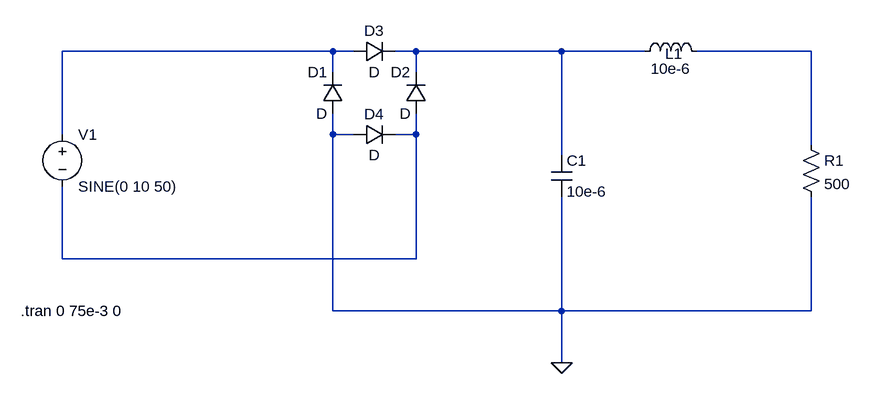
[diagram p0: schematic full_wave_rectifier.asc]
full_wave_rectifier.asc, the LTspice schematic file:
Version 4
SHEET 1 1124 680
WIRE 320 160 -96 160
WIRE 352 160 320 160
WIRE 448 160 416 160
WIRE 672 160 448 160
WIRE 800 160 672 160
WIRE 1056 160 880 160
WIRE 320 192 320 160
WIRE 448 192 448 160
WIRE -96 288 -96 160
WIRE 320 288 320 256
WIRE 352 288 320 288
WIRE 448 288 448 256
WIRE 448 288 416 288
WIRE 1056 304 1056 160
WIRE 672 320 672 160
WIRE -96 480 -96 368
WIRE 448 480 448 288
WIRE 448 480 -96 480
WIRE 320 560 320 288
WIRE 672 560 672 384
WIRE 672 560 320 560
WIRE 1056 560 1056 384
WIRE 1056 560 672 560
WIRE 672 640 672 560
FLAG 672 640 0
SYMBOL voltage -96 272 R0
SYMATTR InstName V1
SYMATTR Value SINE(0 10 50)
SYMBOL diode 336 256 R180
WINDOW 0 24 64 Left 2
WINDOW 3 24 0 Left 2
SYMATTR InstName D1
SYMBOL diode 464 256 R180
WINDOW 0 24 64 Left 2
WINDOW 3 24 0 Left 2
SYMATTR InstName D2
SYMBOL diode 352 176 R270
WINDOW 0 32 32 VTop 2
WINDOW 3 0 32 VBottom 2
SYMATTR InstName D3
SYMBOL diode 352 304 R270
WINDOW 0 32 32 VTop 2
WINDOW 3 0 32 VBottom 2
SYMATTR InstName D4
SYMBOL cap 656 320 R0
SYMATTR InstName C1
SYMATTR Value 10e-6
SYMBOL ind 784 176 R270
WINDOW 0 -3 61 VTop 2
WINDOW 3 5 56 VBottom 2
SYMATTR InstName L1
SYMATTR Value 10e-6
SYMBOL res 1040 288 R0
SYMATTR InstName R1
SYMATTR Value 500
TEXT -160 560 Left 2 !.tran 0 75e-3 0

The netlist it stands for:
* full_wave_rectifier.asc
V1 N001 N004 SINE(0 10 50)
D1 0 N001 D
D2 N004 N002 D
D3 N001 N002 D
D4 0 N004 D
C1 N002 0 10e-6
L1 N002 N003 10e-6
R1 N003 0 500
.model D D
.lib standard.dio
.tran 0 75e-3 0
.backanno
.end